# Altium schematic sheet Block_Diagram.SchDoc
size B; SheetNumber: 1; SheetTotal: 5
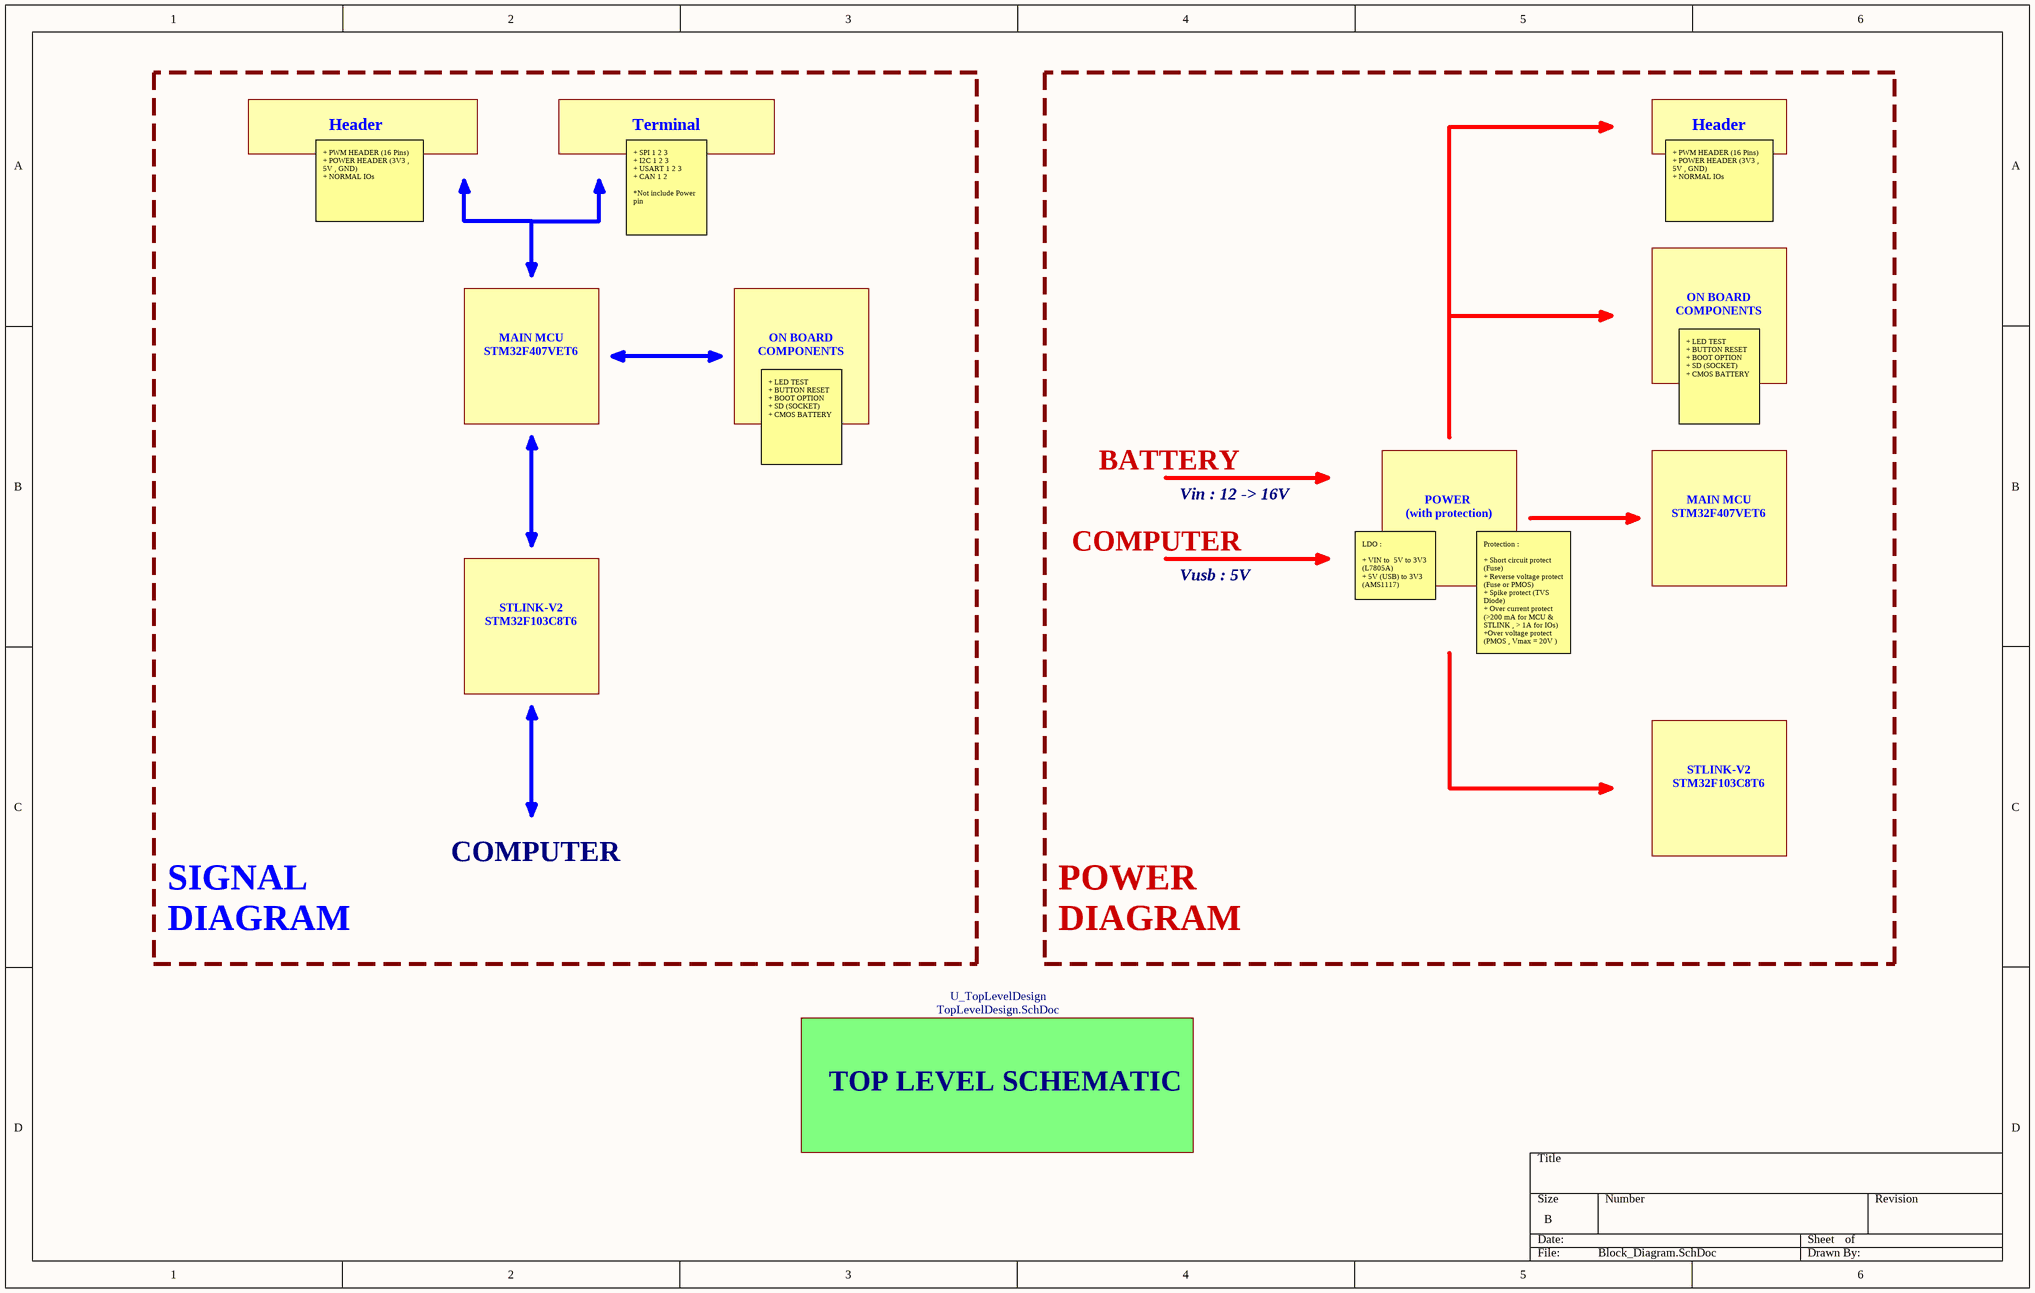
[diagram p0: Block_Diagram.SchDoc]

## Sub-sheets
U_TopLevelDesign = TopLevelDesign.SchDoc: no entries

## Notes on the sheet
- Header
- Terminal
- + PWM HEADER (16 Pins)
  + POWER HEADER (3V3 , 5V , GND)
  + NORMAL IOs
- + SPI 1 2 3
  + I2C 1 2 3
  + USART 1 2 3
  + CAN 1 2
  *Not include Power pin
- MAIN MCU
  STM32F407VET6
- ON BOARD COMPONENTS
- + LED TEST
  + BUTTON RESET
  + BOOT OPTION
  + SD (SOCKET)
  + CMOS BATTERY
- BATTERY
- Vin : 12 -> 16V
- COMPUTER
- POWER
  (with protection)
- STLINK-V2
  STM32F103C8T6
- Vusb : 5V
- LDO :
  + VIN to  5V to 3V3 (L7805A)
  + 5V (USB) to 3V3 (AMS1117)
- Protection :
  + Short circuit protect (Fuse)
  + Reverse voltage protect (Fuse or PMOS)
  + Spike protect (TVS Diode)
  + Over current protect (>200 mA for MCU & STLINK , > 1A for IOs)
  +Over voltage protect (PMOS , Vmax = 20V )
- SIGNAL
  DIAGRAM
- POWER
  DIAGRAM
- TOP LEVEL SCHEMATIC